# Altium schematic sheet Dentist_camera_extender_schematic_sch_2.SchDoc
size A3; SheetNumber: 2; SheetTotal: 4
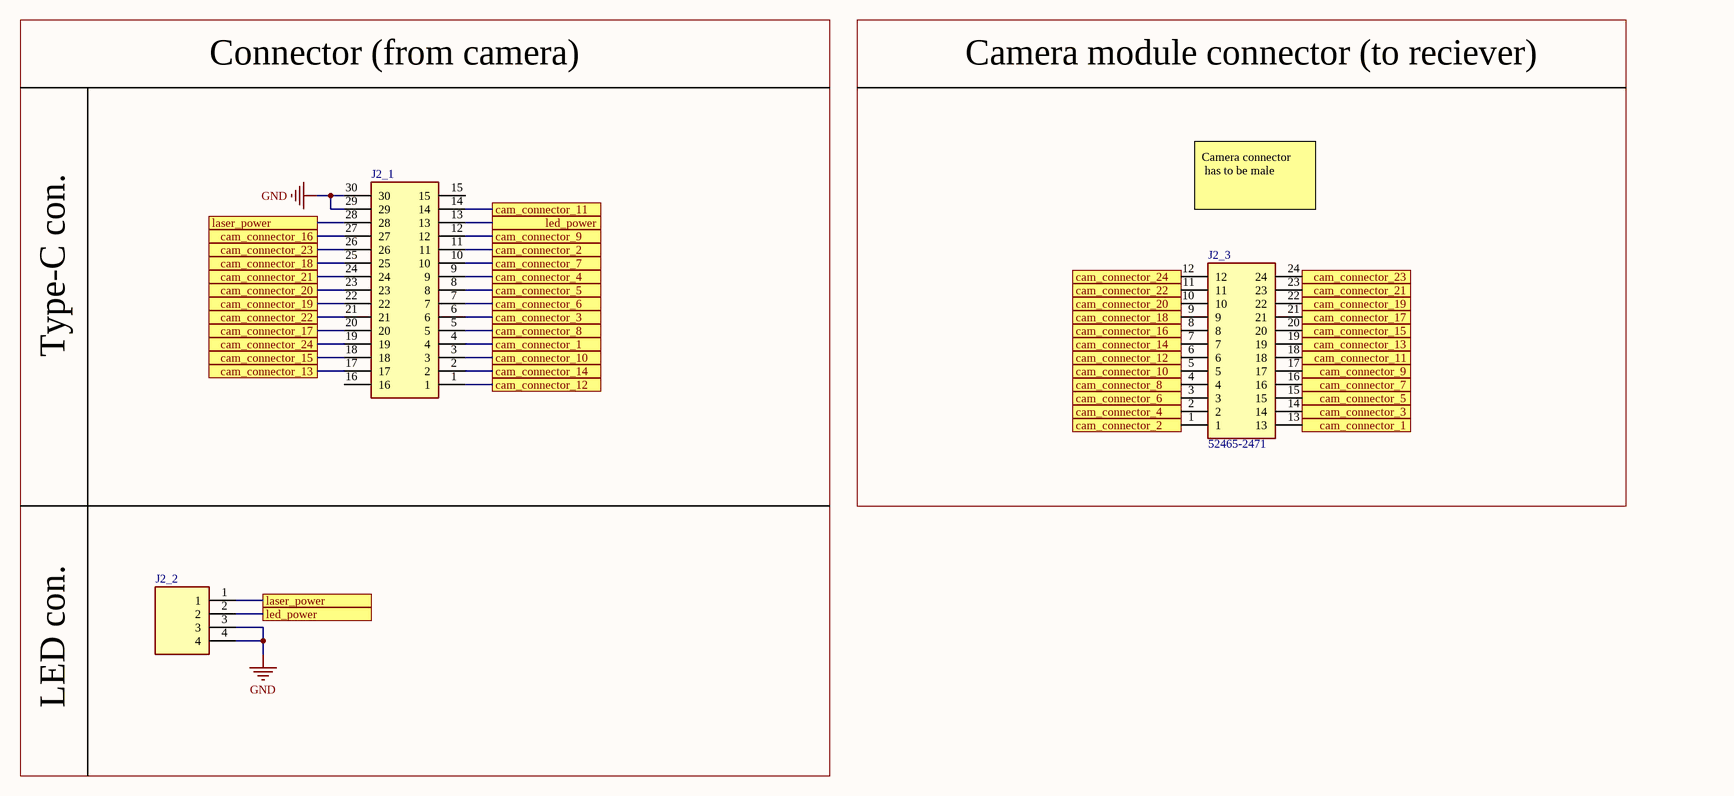
[diagram p0: Dentist_camera_extender_schematic_sch_2.SchDoc]

## Parts
J2_1  30 pin connector  [30_PIN_CONNECTOR]  (value not drawn)
J2_2  B04B-JWPF-SK-R_LF__SN_  [B04BJWPFSKRLFSN]  (value not drawn)
J2_3  52465-2471  [524652471]

## Blocks framed on the sheet
Camera module connector (to reciever): J2_3

## Ports
cam_connector_1, cam_connector_2, cam_connector_3, cam_connector_4, cam_connector_5, cam_connector_6, cam_connector_7, cam_connector_8, cam_connector_9, cam_connector_10, cam_connector_11, cam_connector_12, cam_connector_13, cam_connector_14, cam_connector_15, cam_connector_16, cam_connector_17, cam_connector_18, cam_connector_19, cam_connector_20, cam_connector_21, cam_connector_22, cam_connector_23, cam_connector_24, laser_power, led_power

## Nets
GND: J2_1.29 J2_1.30 J2_2.3 J2_2.4
cam_connector_1: J2_1.4 J2_3.13 ; port cam_connector_1
cam_connector_2: J2_1.11 J2_3.1 ; port cam_connector_2
cam_connector_3: J2_1.6 J2_3.14 ; port cam_connector_3
cam_connector_4: J2_1.9 J2_3.2 ; port cam_connector_4
cam_connector_5: J2_1.8 J2_3.15 ; port cam_connector_5
cam_connector_6: J2_1.7 J2_3.3 ; port cam_connector_6
cam_connector_7: J2_1.10 J2_3.16 ; port cam_connector_7
cam_connector_8: J2_1.5 J2_3.4 ; port cam_connector_8
cam_connector_9: J2_1.12 J2_3.17 ; port cam_connector_9
cam_connector_10: J2_1.3 J2_3.5 ; port cam_connector_10
cam_connector_11: J2_1.14 J2_3.18 ; port cam_connector_11
cam_connector_12: J2_1.1 J2_3.6 ; port cam_connector_12
cam_connector_13: J2_1.17 J2_3.19 ; port cam_connector_13
cam_connector_14: J2_1.2 J2_3.7 ; port cam_connector_14
cam_connector_15: J2_1.18 J2_3.20 ; port cam_connector_15
cam_connector_16: J2_1.27 J2_3.8 ; port cam_connector_16
cam_connector_17: J2_1.20 J2_3.21 ; port cam_connector_17
cam_connector_18: J2_1.25 J2_3.9 ; port cam_connector_18
cam_connector_19: J2_1.22 J2_3.22 ; port cam_connector_19
cam_connector_20: J2_1.23 J2_3.10 ; port cam_connector_20
cam_connector_21: J2_1.24 J2_3.23 ; port cam_connector_21
cam_connector_22: J2_1.21 J2_3.11 ; port cam_connector_22
cam_connector_23: J2_1.26 J2_3.24 ; port cam_connector_23
cam_connector_24: J2_1.19 J2_3.12 ; port cam_connector_24
laser_power: J2_1.28 J2_2.1 ; port laser_power
led_power: J2_1.13 J2_2.2 ; port led_power

Not connected (* = marked no-connect by the designer): J2_1 15 16

## Notes on the sheet
- Connector (from camera)
- Camera connector
  has to be male
- Type-C con.
- LED con.

## Library data of the parts
J2_2 = B04B-JWPF-SK-R_LF__SN_: Connector; Manufacturer_Name: JST (JAPAN SOLDERLESS TERMINALS); Manufacturer_Part_Number: B04B-JWPF-SK-R(LF)(SN); Datasheet Link: https://componentsearchengine.com/Datasheets/2/B04B-JWPF-SK-R(LF)(SN).pdf; Height: 16.6mm
J2_3 = 52465-2471: Connector; Manufacturer_Name: Molex; Datasheet Link: https://www.molex.com/pdm_docs/sd/524652471_sd.pdf; Height: 3.75mm; Manufacturer_Part_Number: 52465-2471; Mouser Part Number: 538-52465-2471; Mouser Price/Stock: https://www.mouser.co.uk/ProductDetail/Molex/52465-2471?qs=oPDuosDifXEuWhdL4yjOXg%3D%3D